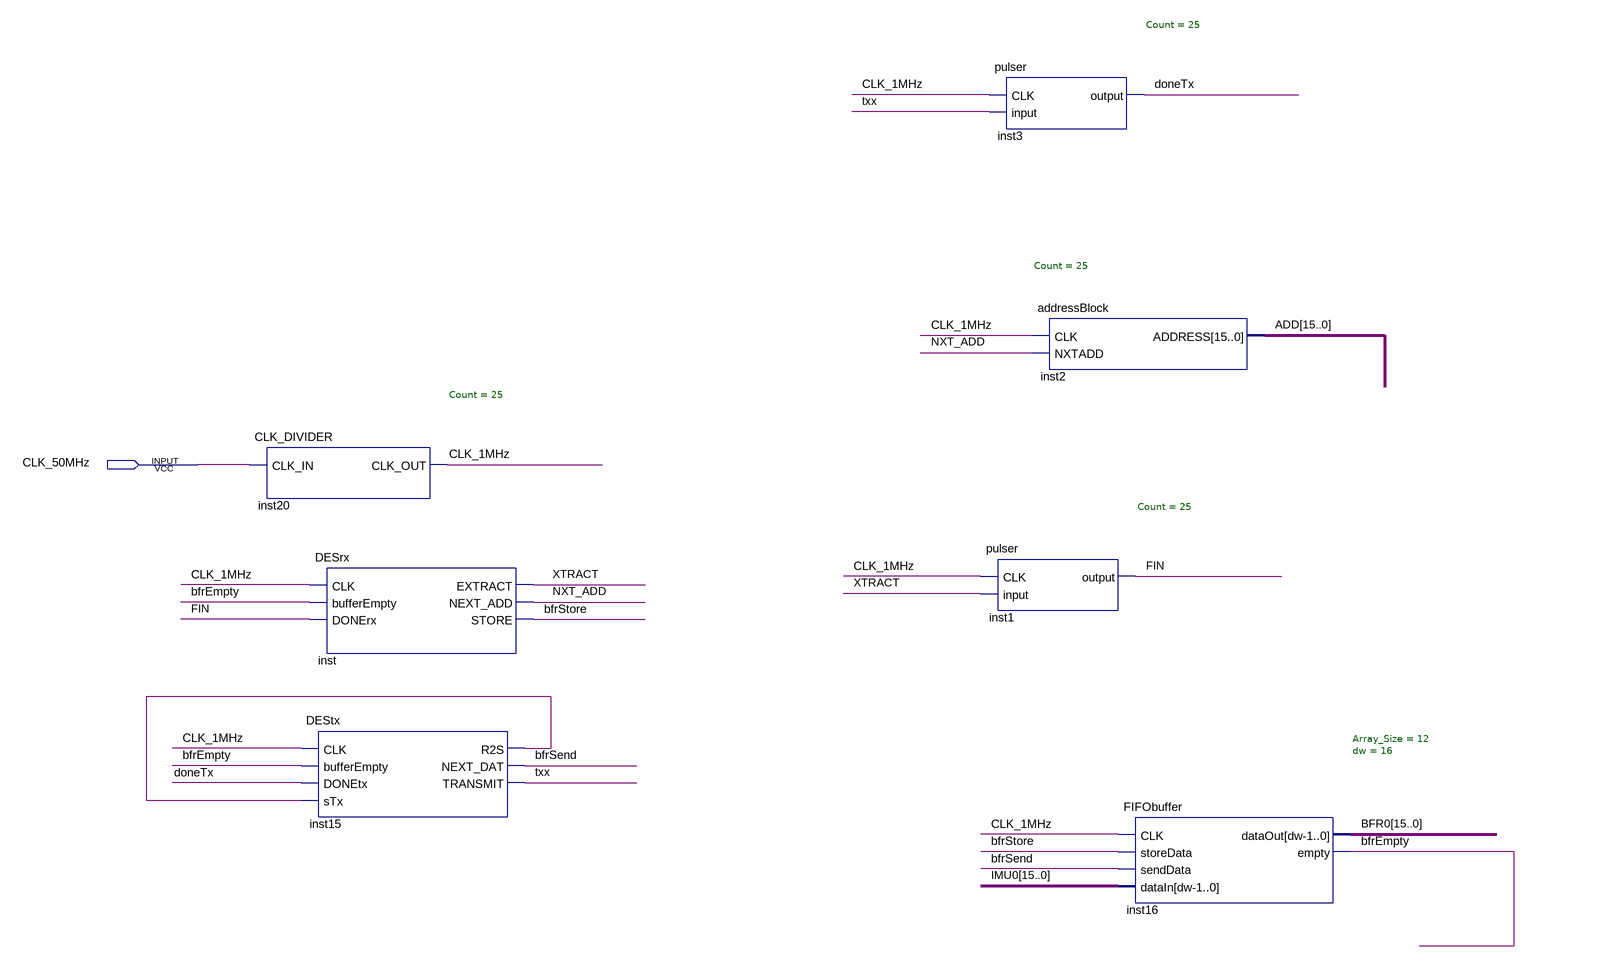
[diagram p0: schematic sheet]
// Quartus schematic SendData.bdf as structural Verilog: 7 symbols, 1 pins
module SendData (
  input  CLK_50MHz
);

  wire bfrEmpty, bfrSend, bfrStore, CLK_1MHz, doneTx, FIN, inst15_r2s, NXT_ADD, txx, XTRACT;
  wire [15:0] ADD, BFR0, IMU0;

  CLK_DIVIDER #(.Count(25)) inst20 (.CLK_IN(CLK_50MHz), .CLK_OUT(CLK_1MHz));
  DESrx inst (
    .CLK(CLK_1MHz), .bufferEmpty(bfrEmpty), .DONErx(FIN), .EXTRACT(XTRACT), .NEXT_ADD(NXT_ADD),
    .STORE(bfrStore));
  DEStx inst15 (
    .CLK(CLK_1MHz), .bufferEmpty(bfrEmpty), .DONEtx(doneTx), .sTx(inst15_r2s), .R2S(inst15_r2s),
    .NEXT_DAT(bfrSend), .TRANSMIT(txx));
  pulser #(.Count(25)) inst3 (.CLK(CLK_1MHz), .\input (txx), .\output (doneTx));
  addressBlock #(.Count(25)) inst2 (.CLK(CLK_1MHz), .NXTADD(NXT_ADD), .ADDRESS(ADD));
  pulser #(.Count(25)) inst1 (.CLK(CLK_1MHz), .\input (XTRACT), .\output (FIN));
  FIFObuffer #(.Array_Size(12), .dw(16)) inst16 (
    .CLK(CLK_1MHz), .storeData(bfrStore), .sendData(bfrSend), .dataIn(IMU0), .dataOut(BFR0), .empty(bfrEmpty));
endmodule
